# EAGLE design 611_jetbot_126 (EAGLE 9.6.2)
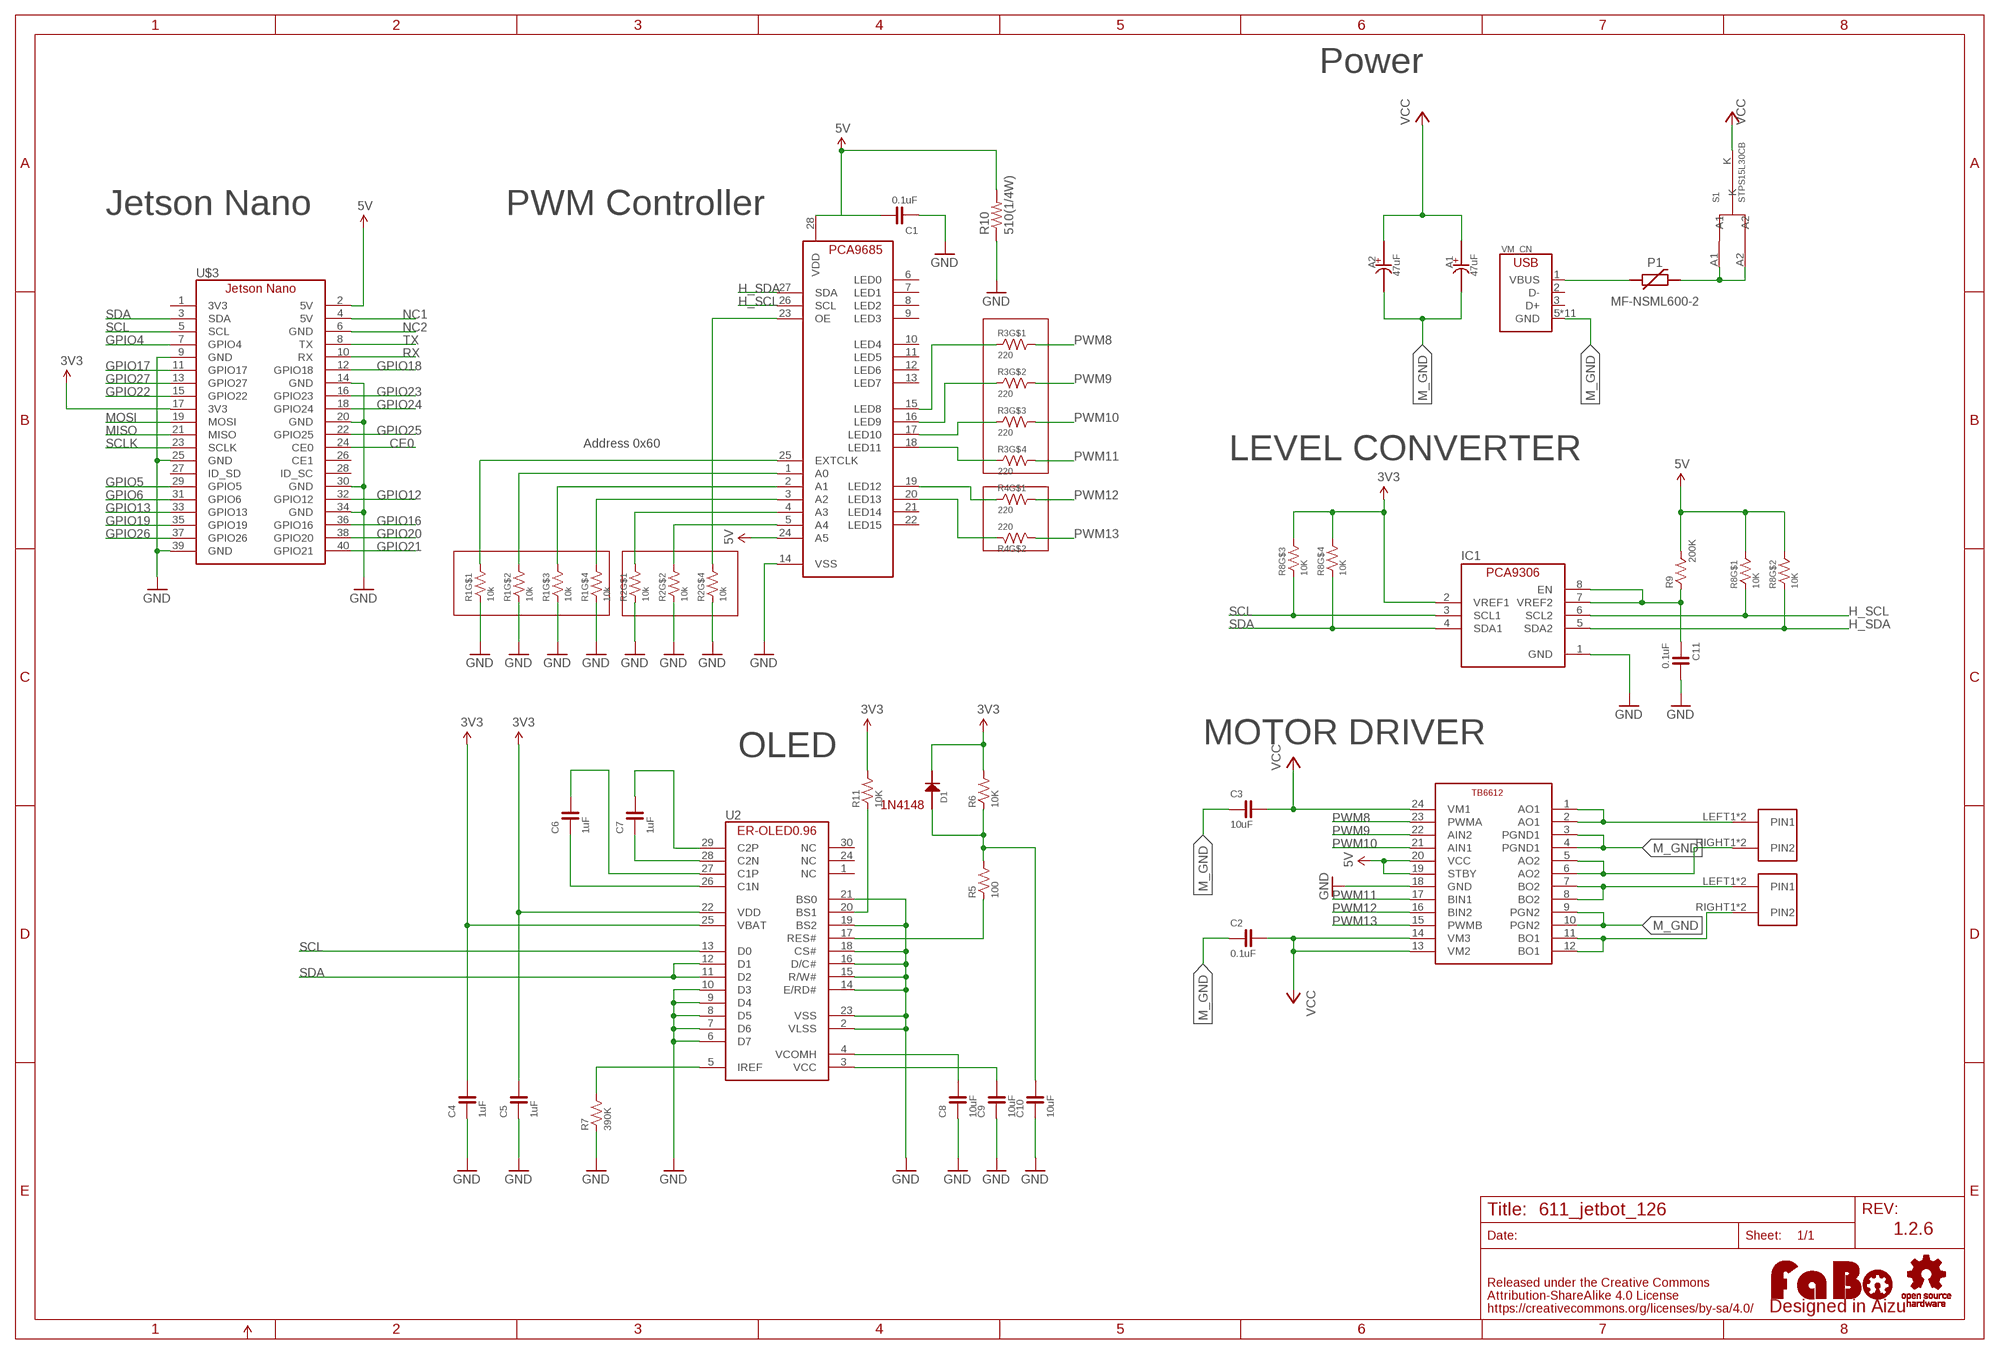
[diagram p0: schematic, sheet 1]

## Parts
A1  47uF  CAPACITOR-ALUMIN_D60  [D60]
A2  47uF  CAPACITOR-ALUMIN_D60  [D60]
C1  0.1uF  CAPACITOR-0603  [0603]
C2  0.1uF  CAPACITOR-0603  [0603]
C3  10uF  CAPACITOR-0603  [0603]
C4  1uF  CAPACITOR-0603-BOTTOM  [0603-BOTTOM]
C5  1uF  CAPACITOR-0603-BOTTOM  [0603-BOTTOM]
C6  1uF  CAPACITOR-0603-BOTTOM  [0603-BOTTOM]
C7  1uF  CAPACITOR-0603-BOTTOM  [0603-BOTTOM]
C8  10uF  CAPACITOR-0603-BOTTOM  [0603-BOTTOM]
C9  10uF  CAPACITOR-0603-BOTTOM  [0603-BOTTOM]
C10  10uF  CAPACITOR-0603-BOTTOM  [0603-BOTTOM]
C11  0.1uF  CAPACITOR-0603  [0603]
D1  1N4148  [1N4148W]
IC1  PCA9306_SSOP  [8PIN-SSOP]
LOGO1  LOGO_FABO-M  [LOGO_FABO_M]
P1  MF-NSML600-2  POLYSWITCH1206  [1206]
R1  10k  RESISTOR_ARRAY  [EXBV8V]
R2  10k  RESISTOR_ARRAY  [EXBV8V]
R3  220  RESISTOR_ARRAY  [EXBV8V]
R4  220  RESISTOR_ARRAY  [EXBV8V]
R5  100  RESISTOR-0603-BOTTOM  [0603-BOTTOM]
R6  10K  RESISTOR-0603-BOTTOM  [0603-BOTTOM]
R7  390K  RESISTOR-0603-BOTTOM  [0603-BOTTOM]
R8  10K  RESISTOR_ARRAY  [EXBV8V]
R9  200K  RESISTOR-0603  [0603]
R10  510(1/4W)  R-US_R0805  [R0805]
R11  10K  RESISTOR-0603-BOTTOM  [0603-BOTTOM]
S1  STPS15L30CB  STPS15L30C  [STPS15L30C]
U2  ER-OLED0.96-1ER-CON30HT-1_REV2  [ER-CON30HT-1_REV2]
U$3  JETSON_NANO  [JETSON_NANO]
U$5  TB6612  [TB6612]
U$6  ML-1400-S1  [ML-1400-S1]
U$8  ML-1400-S1  [ML-1400-S1]
U$9  PCA9685  [PCA9685]
U$11  LOGO_OSHW-M_BOTTOM  [LOGO_OSHW_M_BOTTOM]
VM_CN  USB-ZX62D  [ZX62D-B-5PA8]

## Nets
3V3: C4.2 C5.2 D1.CATHODE IC1.2(VREF1) R6.2 R8.5 R8.6 R11.2 U2.22(VDD) U2.25(VBAT) U$3.17(3V3)
5V: C1.2 R8.7 R8.8 R9.2 R10.2 U$3.2(5V) U$5.19(STBY) U$5.20(VCC) U$9.24(A5) U$9.28(VDD)
CE0: U$3.24(CE0)
GND: C1.1 C4.1 C5.1 C8.1 C9.1 C10.1 C11.2 IC1.1(GND) R1.1 R1.2 R1.3 R1.4 R2.1 R2.2 R2.4 R7.1 R10.1 U2.2(VLSS) U2.6(D7) U2.7(D6) U2.8(D5) U2.9(D4) U2.10(D3) U2.14(E/RD#) U2.15(R/W#) U2.16(D/C#) U2.18(CS#) U2.19(BS2) U2.21(BS0) U2.23(VSS) U$3.9(GND) U$3.14(GND) U$3.20(GND) U$3.25(GND) U$3.30(GND) U$3.34(GND) U$3.39(GND) U$5.18(GND) U$9.14(VSS)
GPIO4: U$3.7(GPIO4)
GPIO5: U$3.29(GPIO5)
GPIO6: U$3.31(GPIO6)
GPIO12: U$3.32(GPIO12)
GPIO13: U$3.33(GPIO13)
GPIO16: U$3.36(GPIO16)
GPIO17: U$3.11(GPIO17)
GPIO18: U$3.12(GPIO18)
GPIO19: U$3.35(GPIO19)
GPIO20: U$3.38(GPIO20)
GPIO21: U$3.40(GPIO21)
GPIO22: U$3.15(GPIO22)
GPIO23: U$3.16(GPIO23)
GPIO24: U$3.18(GPIO24)
GPIO25: U$3.22(GPIO25)
GPIO26: U$3.37(GPIO26)
GPIO27: U$3.13(GPIO27)
H_SCL: IC1.6(SCL2) R8.1 U$9.26(SCL)
H_SDA: IC1.5(SDA2) R8.2 U$9.27(SDA)
M_GND: A1.MINUS(-) A2.MINUS(-) C2.1 C3.1 U$5.3(PGND1) U$5.4(PGND1) U$5.9(PGN2) U$5.10(PGN2) VM_CN.5(GND) VM_CN.B1(GND) VM_CN.B2(GND) VM_CN.B3(GND) VM_CN.B4(GND) VM_CN.T1(GND) VM_CN.T2(GND) VM_CN.T3(GND) VM_CN.T4(GND) VM_CN.T5(GND) VM_CN.T6(GND)
MISO: U$3.21(MISO)
MOSI: U$3.19(MOSI)
N$2: R3.4 U$9.18(LED11)
N$3: R3.3 U$9.17(LED10)
N$4: R3.2 U$9.16(LED9)
N$5: R3.1 U$9.15(LED8)
N$6: R4.1 U$9.19(LED12)
N$7: R2.5 U$9.23(OE)
N$8: R1.8 U$9.25(EXTCLK)
N$9: R1.7 U$9.1(A0)
N$10: R1.6 U$9.2(A1)
N$11: R1.5 U$9.3(A2)
N$12: R2.8 U$9.4(A3)
N$13: R2.7 U$9.5(A4)
N$14: C6.2 U2.27(C1P)
N$15: R4.2 U$9.20(LED13)
N$16: C6.1 U2.26(C1N)
N$17: U$5.1(AO1) U$5.2(AO1) U$6.LEFT1(PIN1) U$6.LEFT2(PIN1)
N$18: U$5.5(AO2) U$5.6(AO2) U$6.RIGHT1(PIN2) U$6.RIGHT2(PIN2)
N$19: C7.1 U2.28(C2N)
N$20: U$5.7(BO2) U$5.8(BO2) U$8.LEFT1(PIN1) U$8.LEFT2(PIN1)
N$21: C7.2 U2.29(C2P)
N$22: U$5.11(BO1) U$5.12(BO1) U$8.RIGHT1(PIN2) U$8.RIGHT2(PIN2)
N$23: R7.2 U2.5(IREF)
N$24: C8.2 U2.4(VCOMH)
N$25: C9.2 U2.3(VCC)
N$26: R5.1 U2.17(RES#)
N$27: C10.2 D1.ANODE R5.2 R6.1
N$28: R11.1 U2.20(BS1)
N$29: C11.1 IC1.7(VREF2) IC1.8(EN) R9.1
NC1: U$3.4(5V)
NC2: U$3.6(GND)
PTCP1: P1.P$1 VM_CN.1(VBUS)
PTCP2: P1.P$2 S1.A1 S1.A2
PWM8: R3.8 U$5.23(PWMA)
PWM9: R3.7 U$5.22(AIN2)
PWM10: R3.6 U$5.21(AIN1)
PWM11: R3.5 U$5.17(BIN1)
PWM12: R4.8 U$5.16(BIN2)
PWM13: R4.7 U$5.15(PWMB)
RX: U$3.10(RX)
SCL: IC1.3(SCL1) R8.3 U2.13(D0) U$3.5(SCL)
SCLK: U$3.23(SCLK)
SDA: IC1.4(SDA1) R8.4 U2.11(D2) U2.12(D1) U$3.3(SDA)
TX: U$3.8(TX)
VCC: A1.PLUS(+) A2.PLUS(+) C2.2 C3.2 S1.K U$5.13(VM2) U$5.14(VM3) U$5.24(VM1)
Unconnected: R2.3 R2.6 R4.3 R4.4 R4.5 R4.6 U2.1(NC) U2.24(NC) U2.30(NC) U$3.1(3V3) U$3.26(CE1) U$3.27(ID_SD) U$3.28(ID_SC) U$9.6(LED0) U$9.7(LED1) U$9.8(LED2) U$9.9(LED3) U$9.10(LED4) U$9.11(LED5) U$9.12(LED6) U$9.13(LED7) U$9.21(LED14) U$9.22(LED15) VM_CN.2(D-) VM_CN.3(D+)

## Notes on the sheet
- Power
- Jetson Nano | PWM Controller
- Address 0x60
- LEVEL CONVERTER
- MOTOR DRIVER
- OLED
- 1N4148
- 1.2.6

## Library data of the parts
A1 A2 = FaBo-Capacitor:CAPACITOR-ALUMIN
C1-C11 = FaBo-Capacitor:CAPACITOR: CAPACITOR
D1 = FaBo-Diode:1N4148
IC1 = FaBo-LevelTranslator:PCA9306
LOGO1 = component:LOGO_FABO
P1 = FaBo-Supply:POLYSWITCH
R1-R4 R8 = component:RESISTOR_ARRAY
R5-R7 R9 R11 = FaBo-Resistors:RESISTOR: RESISTOR
R10 = rcl:R-US_: RESISTOR, American symbol; SPICEPREFIX: R
S1 = FaBo-Supply:STPS15L30C
U2 = FaBo-Display:ER-OLED0.96-1: ER-CON30HT-1 Rev2 wide distance 0.23mm
U$3 = FaBo-Boards:JETSON_NANO
U$5 = FaBo-Motor:TB6612
U$6 U$8 = FaBo-Terminal:ML-1400-S1
U$9 = FaBo-Motor:PCA9685
U$11 = component:LOGO_OSHW
VM_CN = component:USB

## Board
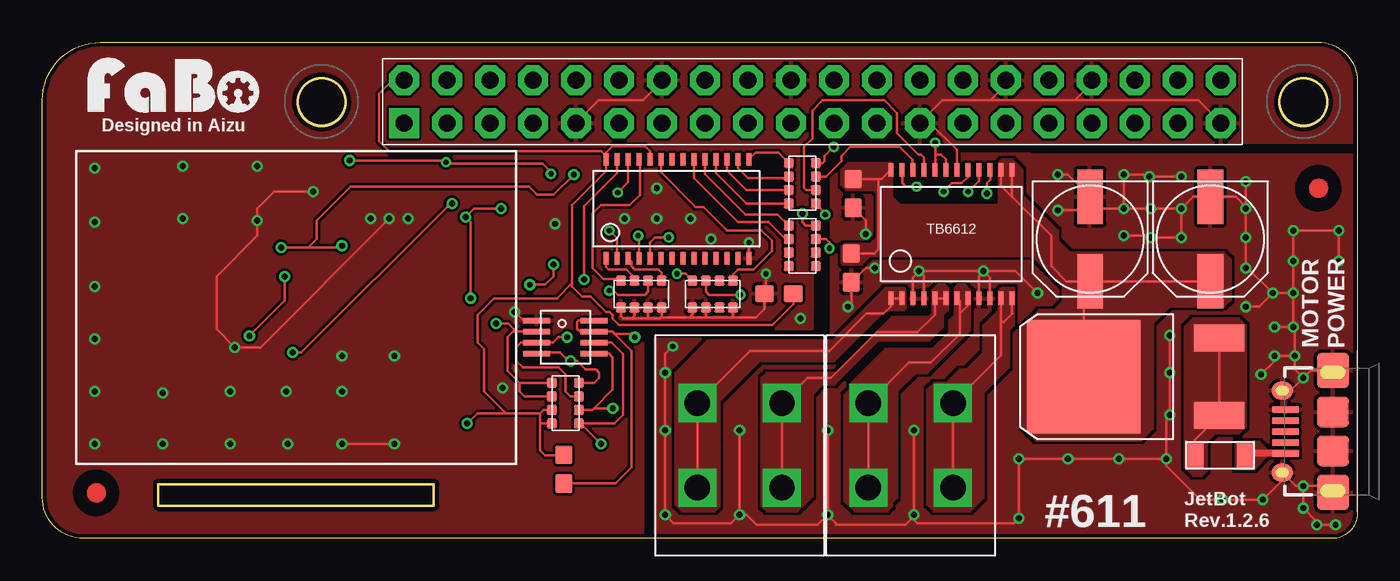
[diagram p1: board, top side]
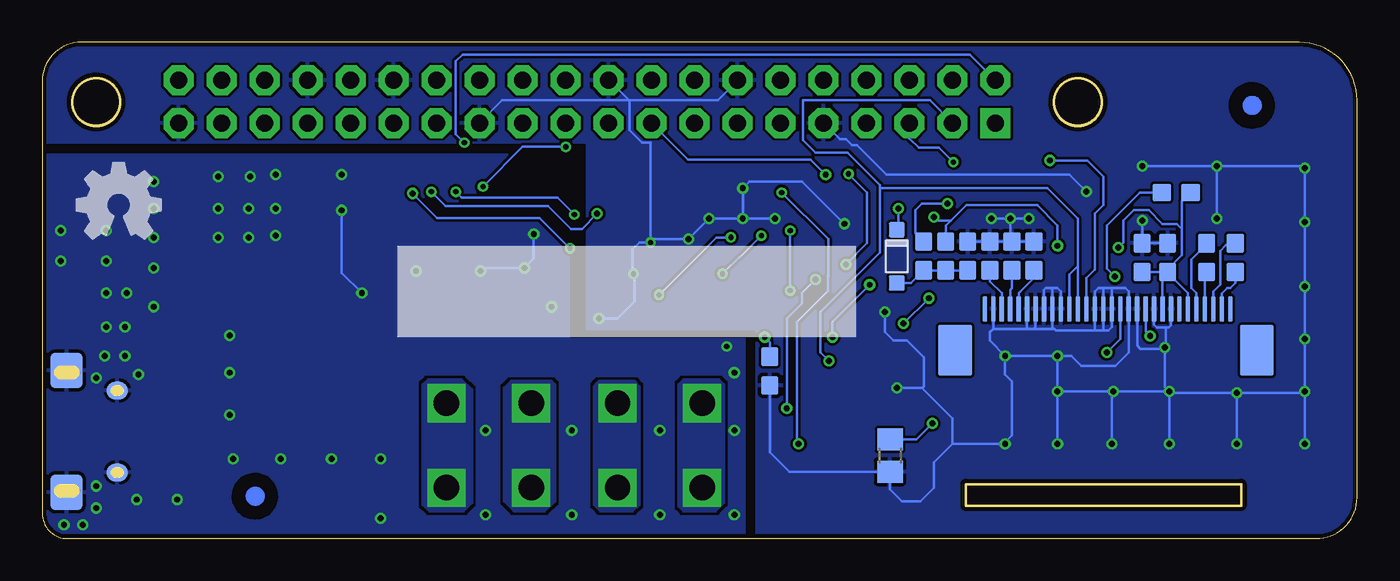
[diagram p2: board, bottom side, seen from below]

Size 77.68 x 29.33 mm. Coordinates in mm from the lower left corner, seen from the top.
Outline: 6.85,1.94 23.13,1.94 23.13,3.21 6.85,3.21 6.85,1.94
Outline: circle at 16.5,25.8 radius 1.4
Outline: circle at 74.5,25.8 radius 1.4
Copper layers (1*16): Top 0.035mm / dielectric 1.6mm / Bottom 0.035mm
Design rules "PCBway": minimum track width 6mil, minimum drill 12mil, track to track 6mil, track to pad 6mil, pad to pad 6mil, via to via 6mil, smd to smd 6mil, copper to edge 10mil, drill to drill 10mil, minimum pad ring 10mil, minimum via ring 6mil, stop-mask expansion 2mil, vias tented up to drill 100mil, thermal gap 8mil
tRestrict: area 51.2,13.3 to 52.3,13.7
bRestrict: 7 lines

### Footprints (pad centres in the part's own frame; a part is rotated, then mirrored left to right if it is on the bottom)
D60 = smd 3.2 x 1.524: MINUS -2.5,0; PLUS 2.5,0
0603 = smd 1.1 x 1: 1 -0.85,0; 2 0.85,0
0603-BOTTOM = smd 1.1 x 1 bottom: 1 -0.85,0; 2 0.85,0
1N4148W = smd 0.9 x 0.95: ANODE 0,0; CATHODE 3.15,0
8PIN-SSOP = smd 0.3 x 1.6: 1 -0.975,-1.7; 2 -0.325,-1.7; 3 0.325,-1.7; 4 0.975,-1.7; 5 0.975,1.7; 6 0.325,1.7; 7 -0.325,1.7; 8 -0.975,1.7
1206 = smd 1 x 1.6: P$1 -1.5,0; P$2 1.5,0
EXBV8V = smd 0.6 x 0.6: 1 -1.2,-0.8; 2 -0.4,-0.8; 3 0.4,-0.8; 4 1.2,-0.8; 5 1.2,0.8; 6 0.4,0.8; 7 -0.4,0.8; 8 -1.2,0.8
R0805 = smd 1.3 x 1.5: 1 -0.95,0; 2 0.95,0
STPS15L30C = smd 1.6 x 3: A1 -2.286,-6.13; A2 2.286,-6.13 | smd 6.7 x 6.7: K 0,1.87
ER-CON30HT-1_REV2 = smd 0.27 x 1.5 bottom: 1 7,-0.23; 2 6.5,-0.23; 3 6,-0.23; 4 5.5,-0.23; 5 5,-0.23; 6 4.5,-0.23; 7 4,-0.23; 8 3.5,-0.23; 9 3,-0.23; 10 2.5,-0.23; 11 2,-0.23; 12 1.5,-0.23; 13 1,-0.23; 14 0.5,-0.23; 15 0,-0.23; 16 -0.5,-0.23; 17 -1,-0.23; 18 -1.5,-0.23; 19 -2,-0.23; 20 -2.5,-0.23; 21 -3,-0.23; 22 -3.5,-0.23; 23 -4,-0.23; 24 -4.5,-0.23; 25 -5,-0.23; 26 -5.5,-0.23; 27 -6,-0.23; 28 -6.5,-0.23; 29 -7,-0.23; 30 -7.5,-0.23 | smd 2 x 3 bottom: 31 -9.07,-2.67; 32 8.74,-2.67
JETSON_NANO = drill 1 pad 1.778 square: 1 -24.13,10.16 | drill 1 pad 1.778 octagon: 2 -24.13,12.7; 3 -21.59,10.16; 4 -21.59,12.7; 5 -19.05,10.16; 6 -19.05,12.7; 7 -16.51,10.16; 8 -16.51,12.7; 9 -13.97,10.16; 10 -13.97,12.7; 11 -11.43,10.16; 12 -11.43,12.7; 13 -8.89,10.16; 14 -8.89,12.7; 15 -6.35,10.16; 16 -6.35,12.7; 17 -3.81,10.16; 18 -3.81,12.7; 19 -1.27,10.16; 20 -1.27,12.7; 21 1.27,10.16; 22 1.27,12.7; 23 3.81,10.16; 24 3.81,12.7; 25 6.35,10.16; 26 6.35,12.7; 27 8.89,10.16; 28 8.89,12.7; 29 11.43,10.16; 30 11.43,12.7; 31 13.97,10.16; 32 13.97,12.7; 33 16.51,10.16; 34 16.51,12.7; 35 19.05,10.16; 36 19.05,12.7; 37 21.59,10.16; 38 21.59,12.7; 39 24.13,10.16; 40 24.13,12.7
TB6612 = smd 0.3 x 0.8: 1 -3.575,-3.8; 2 -2.925,-3.8; 3 -2.275,-3.8; 4 -1.625,-3.8; 5 -0.975,-3.8; 6 -0.325,-3.8; 7 0.325,-3.8; 8 0.975,-3.8; 9 1.625,-3.8; 10 2.275,-3.8; 11 2.925,-3.8; 12 3.575,-3.8; 13 3.575,3.8; 14 2.925,3.8; 15 2.275,3.8; 16 1.625,3.8; 17 0.975,3.8; 18 0.325,3.8; 19 -0.325,3.8; 20 -0.975,3.8; 21 -1.625,3.8; 22 -2.275,3.8; 23 -2.925,3.8; 24 -3.575,3.8
ML-1400-S1 = drill 1.5 square: LEFT1 -2.5,2.5; LEFT2 -2.5,-2.5; RIGHT1 2.5,2.5; RIGHT2 2.5,-2.5
PCA9685 = smd 0.3 x 0.75: 1 -4.15,-2.93; 2 -3.5,-2.93; 3 -2.85,-2.93; 4 -2.2,-2.93; 5 -1.55,-2.93; 6 -0.9,-2.93; 7 -0.25,-2.93; 8 0.4,-2.93; 9 1.05,-2.93; 10 1.7,-2.93; 11 2.35,-2.93; 12 3,-2.93; 13 3.65,-2.93; 14 4.3,-2.93; 15 4.3,2.92; 16 3.65,2.92; 17 3,2.92; 18 2.35,2.92; 19 1.7,2.92; 20 1.05,2.92; 21 0.4,2.92; 22 -0.25,2.92; 23 -0.9,2.92; 24 -1.55,2.92; 25 -2.2,2.92; 26 -2.85,2.92; 27 -3.5,2.92; 28 -4.15,2.92
ZX62D-B-5PA8 = smd 0.4 x 1.6: 1 -1.3,4.25; 2 -0.65,4.25; 3 0,4.25; 4 0.65,4.25; 5 1.3,4.25 | smd 1.05 x 1.25 bottom: B1 -2.425,4.45; B2 2.425,4.45 | smd 2.1 x 1.9 bottom: B3 -3.6,1.45; B4 3.6,1.45 | smd 1.05 x 1.25: T1 -2.425,4.45; T2 2.425,4.45 | smd 2.1 x 1.9: T3 -3.6,1.45; T6 3.6,1.45 | smd 1.8 x 1.9: T4 -1.15,1.45; T5 1.15,1.45

### Placement (x,y rotation side)
A1  69,17.7 270 top
A2  61.9,17.7 270 top
C1  43.52,14.47 0 top
C2  47.8,16 90 top
C3  47.9,20.4 90 top
C4  11.2,16.6 270 top
C5  12.7,16.6 270 top
C6  8.9,16.6 270 top
C7  7.2,16.6 270 top
C8  20.4,16.7 270 top
C9  21.7,16.7 270 top
C10  23,16.7 270 top
C11  34.7,9.9 270 bottom
D1  27.2,15.1 90 bottom
IC1  30.9,11.9 270 top
LOGO1  7.76,24.8 0 top
P1  69.58,4.92 180 top
R1  35.39,14.44 0 top
R2  39.6,14.44 0 top
R3  44.9,21 270 top
R4  44.9,17.3 270 top
R5  25.6,16.7 270 top
R6  24.3,16.7 90 top
R7  19.1,16.7 270 top
R8  30.9,8 90 top
R9  30.8,4.1 90 top
R10  27.6,4.9 90 bottom
R11  10.7,20.45 180 top
S1  63.39,9.57 90 top
U2  15,13.8 0 top
U$2  [MARK_POINT_3MM]  3.2,2.7 0 top
U$3  45.5,14.4 0 top
U$4  [MARK_POINT_3MM]  75.4,20.7 0 top
U$5  53.7,18 0 top
U$6  41.2,5.5 0 top
U$7  [MARK_POINT_3MM]  6.2,25.6 0 bottom
U$8  51.3,5.5 0 top
U$9  37.45,19.49 0 top
U$10  [MARK_POINT_3MM]  65.1,2.5 0 bottom
U$11  73.16,19.72 0 top
VM_CN  77.7,6.32 90 top

### Tracks (layer width: path | path; a pad name or v marks a point on that pad's centre or on a via)
3V3  (via drill 0.35)
  Top 0.152: R8.5 28.2,9.2 | 28.2,9.2 27.5,9.9 27.5,11.9 27.82,12.22 28,12.22 | 28,12.22 IC1.2 | R8.6 28.5,8.4 28.2,8.7 28.2,9.2 | v26.8,12.7 27.52,12.7 28,12.22 | v14.1,17.2 15.7,17.2 | 15.7,17.2 17.6,17.2 v17.7,17.3 | v31.4,21.5 30.22,20.32 29.23,20.32 28.75,20.8 18.2,20.8 16.2,18.8 16.2,17.7 15.7,17.2 | v25.3,14.2 25.3,18.7 v25,19 25.5,19.5 v27.1,19.5
  Bottom 0.152: 11.03,15.58 11.07,15.63 | C4.2 11.07,15.75 11.07,15.63 | 11.07,15.63 11.07,15.58 10,14.5 U2.25 | 14.1,17.15 v14.1,17.2 13.8,17.5 13.8,18.8 13.2,19.4 12.3,19.4 11.5,18.6 10.65,18.6 10.35,18.3 | R6.2 24.3,18.5 24,18.8 | 24,18.8 23.1,19.7 18.9,19.7 17.7,18.5 v17.7,17.3 | v26.8,12.7 v25.3,14.2 | v25,19 24.8,18.8 24,18.8 | D1.CATHODE 27.1,18.35 v27.1,19.5 | v31.4,21.5 32.3,22.4 39.53,22.4 U$3.17 | R11.2 10.35,19.95 10.35,18.3 | C4.2 11.2,15.89 | 11.2,15.89 10.35,16.75 10.35,18.3 | C5.2 11.34,15.75 11.2,15.89 | U2.22 11.5,15.45 C4.2
5V  (via drill 0.3, 0.35)
  Top 0.152: 29.4,7.4 29.6,7.6 R8.7 | 27.4,7.4 26.1,8.7 26.1,11.2 25.7,11.6 25.7,13.2 26.7,14.2 30.4,14.2 31.3,15.1 | 27.4,7.4 29.4,7.4 | U$9.24 35.9,22.9 35.6,23.2 33.7,23.2 33.3,22.8 33.3,22.6 | 53.3,21.88 U$5.19 53.38,22.42 53.1,22.7 52.75,22.7 | 31.3,15.1 31.3,14.9 31.9,14.3 32.4,14.3 33.3,13.4 33.5,13.4 33.7,13.2 33.7,13 34.07,12.63 34.8,12.63 34.81,12.62 43.12,12.62 44.37,13.87 C1.2 | 31.3,15.1 31.3,19.7 33.3,21.7 U$9.28 | U$5.20 52.75,21.83 52.75,22.7 | v52.75,23.4 52.75,22.7 | 33.3,22.5 U$9.28 | U$9.28 33.3,22.6 | 33.3,22.6 33,22.9 20.5,22.9 19.9,23.5 19.9,26.3 20.7,27.1 U$3.2 | v25.1,6.8 25.7,7.4 27.4,7.4 | R9.2 30.75,4.9 29.7,4.9 29.4,5.2 29.4,6.9 | 29.4,7.4 29.4,6.9 | R8.8 29.5,6.8 29.4,6.9
  Bottom 0.152: v52.75,23.4 53.25,23.9 53.25,28.2 52.84,28.61 22.88,28.61 U$3.2 | R10.2 26.05,5.85 v25.1,6.8
GND  (via drill 0.3, 0.35)
  Top 0.152: 56,25.9 53.19,25.9 U$3.25 52.44,24.56 54.02,22.98 U$5.18 | R1.1 34.19,13.11 34.3,13 34.8,13 | 36.55,13.05 36.5,13 35.7,13 | 36.55,13.05 36.6,13.1 R1.4 | 34.8,13 35.7,13 | R1.3 35.79,13.09 35.7,13 | R1.2 34.99,13.19 34.8,13 | R2.1 38.4,13.25 38.2,13.05 | 36.55,13.05 38.2,13.05 | R2.4 40.8,13.11 40.75,13.05 | 38.2,13.05 39.2,13.05 | 39.2,13.05 40.75,13.05 | R2.2 39.2,13.05 | 40.75,13.05 42.15,13.05 42.66,13.56 C1.1 42.75,14.56 v42.75,15.65 | U$9.14 v41.75,17.5 | IC1.1 28.43,12.88 v27.9,13.4 | v20.5,18.9 12.9,11.3 v11.37,11.3 10.3,12.37 10.3,15.5 12.7,17.9 v12.7,18.8 12.7,19.5 13.7,20.5 v16,20.5 | U$3.30 56.93,26.83 56,25.9 | U$3.39 68.29,25.9 61,25.9 | 56,25.9 61,25.9 | U$3.34 62.01,26.91 61,25.9 | U$3.14 36.61,27.01 35.5,25.9 32.87,25.9 U$3.9 | v20.8,5.6 v17.7,5.6
  Bottom 0.152: 11.2,17.6 C4.1 C5.1 v12.7,18.8 | v41.75,17.5 41.75,23.4 42.25,23.4 43,24.15 43,25.9 | 43,25.9 37.75,25.9 36.61,27.04 U$3.14 | v36.3,18.9 v36.3,20.7 35.9,21.1 32.8,21.1 v30.3,18.6 | v36.3,18.9 v38.3,18.9 v39.5,17.7 41.55,17.7 v41.75,17.5 | v36.3,18.9 v34.4,18.9 | v41.75,17.5 42.4,17.5 42.8,17.1 42.8,15.7 v42.75,15.65 42.7,15.6 42.7,14 43.7,13 v44.8,13 | 27.9,13.5 v27.9,13.4 27.9,12.2 27.4,11.7 26.6,11.7 25.6,10.7 25.6,9 25.7,8.9 | 43,25.9 43.03,25.9 | 43.03,25.9 U$3.20 | U$3.25 50.51,25.9 43.03,25.9 | 21.5,12.4 19.4,12.4 | 19.4,12.4 19.1,12.4 | 19.1,12.4 17.9,12.4 | 17.9,12.4 18,12.5 U2.9 18,14.7 18.1,14.8 | 11.3,12.47 11.82,12.47 12,12.65 U2.21 | 11.3,12.47 11.12,12.47 11,12.6 U2.23 | R7.1 C8.1 | C8.1 C9.1 C10.1 | C8.1 20.5,17.65 v20.5,18.9 | 11.3,12.47 11.3,11.37 v11.37,11.3 11.37,11.2 | 21.5,12.4 21.7,12.2 21.7,11.7 v20.8,10.8 | v16,20.5 17,21.51 27.8,21.51 29.54,23.24 29.85,23.24 30.21,23.6 30.57,23.6 U$3.9 | v19.4,18.9 v20.5,18.9 | v20.5,18.9 v21.6,18.9 | v12.7,22 8.4,22 | 8.4,22 v8.3,22 3.2,22 v3.1,21.9 v3.1,18.7 v3.1,14.9 v3.1,11.8 v3.1,8.7 | v3.1,8.7 3.2,8.6 v7.1,8.6 | 11.37,11.2 11.37,8.97 v11.1,8.7 | v11.1,8.7 11,8.6 v7.1,8.6 | v11.1,8.7 v14.4,8.7 | v14.4,8.7 v17.7,8.7 | v17.7,10.8 v17.7,8.7 | v3.1,8.7 v3.1,5.6 | v7.1,8.6 v7.1,5.6 | v11.1,8.7 v11.1,5.6 | v14.4,8.7 14.5,8.6 v14.5,5.6 | v17.7,8.7 v17.7,5.6 | v20.8,5.6 20.9,5.6 | 20.9,5.6 23.9,5.6 | v8.3,18.9 8.3,21.9 8.4,22 | 23.9,5.6 25,4.5 25,3 25.8,2.2 26.9,2.2 27.6,2.9 R10.1 33.55,3.95 34.7,5.1 C11.2 | 23.9,5.6 23.9,7.1 25.7,8.9 | 25.7,8.9 v27.2,8.9 | U2.19 13,11.4 12.8,11.2 11.37,11.2 | v17.7,10.8 16.9,10.8 16.3,10.2 14.3,10.2 13.5,11 U2.18 13.5,14.6 13.7,14.8 14.5,14.8
  Bottom 0.152: 17.9,12.4 17.8,12.3 15.6,12.3 | 15,12.3 14.7,12.3 14.5,12.5 U2.16 14.5,14.8 | 15,12.3 15.6,12.3 | 15,12.3 U2.15 15,14.8 | 15.6,12.3 15.5,12.4 U2.14 15.5,14.6 15.3,14.8 15,14.8 | 18.1,14.8 17.7,14.8 17.5,14.6 U2.10 | 18.1,14.8 18.4,14.8 18.5,14.7 U2.8 | U2.2 21.5,12.4 | U2.6 19.5,12.5 19.4,12.4 | U2.7 19,12.5 19.1,12.4 | 14.5,14.8 15,14.8 | v20.8,10.8 v17.7,10.8 | v20.8,10.8 20.8,9.69 20.4,9.29 20.4,6.1 20.9,5.6
  pour Top: -0.5,-0.33 35.5,-0.33 35.5,12.4 45.5,12.4 45.5,23.4 77.5,23.4 77.5,29.77 -0.5,29.77
  pour Bottom: -0.5,-0.33 35.5,-0.33 35.5,12.4 45.5,12.4 45.5,23.4 77.5,23.4 77.5,29.77 -0.5,29.77
H_SCL  (via drill 0.3, 0.35)
  Top 0.152: IC1.6 33.62,11.58 34.3,10.9 34.3,7.3 33.8,6.8 R8.1 31.8,6.8 v33,5.6 | U$9.26 34.6,21.05 v34,20.45
  Bottom 0.152: v34,20.45 31.25,17.7 31.25,15.54 31.26,15.53 31.26,14.64 33.1,12.8 33.1,5.6 v33,5.6
H_SDA  (via drill 0.35)
  Top 0.152: R8.2 32.5,7.6 32.6,7.7 | 32.6,7.7 33.7,8.8 33.7,10.7 33.48,10.93 IC1.5 | v32,15.3 32,19.65 33.95,21.6 U$9.27 | v33.7,7.7 32.6,7.7
  Bottom 0.152: v32,15.3 32.8,14.5 32.8,13.9 33.7,13 v33.7,7.7
M_GND  (via drill 0.3, 0.35)
  Top 0.152: v49.2,16 48.65,16 C2.1 47.8,13.9 v47.6,13.7 | v48.64,18 48.64,18.81 C3.1 | U$5.3 51.42,15.42 v51.8,15.8 | U$5.4 52.08,15.53 v51.8,15.8 | U$5.9 55.33,15.53 v55.6,15.8 | U$5.10 55.98,15.42 v55.6,15.8 | v51.8,15.8 v55.6,15.8 | v55.6,15.8 57.5,15.8 v58.8,14.5 | v66.4,4.7 v63.6,4.7 v60.6,4.7 v57.7,4.7 v57.7,1.2 57.4,0.9 51.7,0.9 51.5,1.1 51.5,1.3 | v66.4,4.7 66.4,4.3 68.4,2.3 v69.7,2.3 v72.1,2.3 73.25,3.45 VM_CN.T1 74.05,3.1 v74.5,3.1 | v74.5,3.1 75.87,3.1 VM_CN.T3 | v74.5,3.1 v74.5,1.8 75.3,1 v75.3,0.8 v76.4,0.8 | v72.7,14.5 71.2,16 v71.1,16 v71.1,17.8 v71.1,19.5 71.1,19.6 | v72.7,14.5 71.9,13.7 v71.1,13.7 | 71.1,19.6 v71.1,21.1 | 71.1,19.6 70.5,20.2 A1.MINUS 68,20.2 v67.3,19.5 | v72.7,14.5 v73.9,14.5 | v73.9,14.5 v73.9,12.5 | v73.9,12.5 v72.8,12.5 | v73.9,12.5 74,12.4 v74,10.8 | v74,10.8 v72.8,10.8 72.8,10.5 v72,9.7 | v74,10.8 74,10 v74.5,9.5 | v74.5,9.5 73.75,8.75 VM_CN.T2 | v74.5,9.5 74.92,9.92 VM_CN.B4 | v73.9,14.5 v73.9,16.4 v73.9,18.2 v76.6,18.2 v76.6,16.4 | v66.4,4.7 66.4,7.1 v66.6,7.3 v66.6,9.8 v66.6,12 | v63.9,17.9 65.4,17.9 v65.5,17.8 v67.3,17.8 v67.3,19.5 | v67.3,19.5 v65.5,19.5 v63.9,19.5 | v63.9,19.5 v63.9,21.5 65.3,21.5 v65.4,21.4 v67.3,21.4 | v60,21.5 60.6,21.5 A2.MINUS | v60,19.4 61.1,19.4 A2.MINUS | v63.9,19.5 62.6,19.5 A2.MINUS | 51.5,1.3 v51.5,1.4 v51.5,6.4 | v41.2,1.4 40.7,0.9 37.3,0.9 v36.8,1.4 v36.8,6.4 v36.8,9.8 36.8,10.9 v37.25,11.35 | v41.2,1.4 41.6,1.4 42.2,0.8 45.8,0.8 v46.4,1.4 | v46.4,1.4 46.9,0.9 46.9,0.8 51,0.8 51.5,1.3 | v46.4,6.4 v46.4,1.4 | v41.2,6.4 v41.2,1.4
  Bottom 0.152: v48.64,18 48.64,16.56 v49.2,16 51.6,16 v51.8,15.8 | v58.8,14.5 60,15.7 v60,19.4
  pour Top (rank 6): 46.6,22.75 58.3,22.75 58.3,22.7 78.5,22.7 78.5,-1.1 36.2,-1.1 36.2,11.8 46.6,11.8
  pour Bottom (rank 6): 36.2,11.8 46.6,11.8 46.6,22.7 77.5,22.7 77.5,-0.4 77.4,-0.5 36.2,-0.5
N$2
  Top 0.152: R3.4 41.6,19.8 39.8,21.6 U$9.18
N$3
  Top 0.152: U$9.17 40.45,21.75 41.6,20.6 R3.3
N$4
  Top 0.152: R3.2 44,21.3 41.7,21.3 41.1,21.9 U$9.16
N$5
  Top 0.152: U$9.15 42.14,22.8 43.5,22.8 R3.1
N$6
  Top 0.152: U$9.19 39.15,21.55 41.54,19.16 43.1,19.16 43.33,19.16 43.44,19.16 R4.1
N$7
  Top 0.152: R2.5 40.8,15.6 41.1,15.9 42,15.9 43.1,17 43.1,17.6 42.5,18.2 40.45,18.2 39.05,19.6 38.6,19.6 36.55,21.65 U$9.23
N$8
  Top 0.152: R1.8 34.09,15.35 33.16,15.35 32.5,16 32.5,19.2 33,19.7 34.7,19.7 35.3,20.3 35.3,22.37 U$9.25
N$9
  Top 0.152: R1.7 34.99,15.41 34.5,15.9 33.45,15.9 33.3,16.05 U$9.1 33.27,16.54
N$10  (via drill 0.3)
  Top 0.152: v33.5,14.65 33.75,14.65 34,14.4 35.6,14.4 35.79,14.59 R1.6 | v33.5,18.2 33.95,17.75 U$9.2
  Bottom 0.152: v33.5,18.2 v33.5,14.65
N$11
  Top 0.152: U$9.3 34.8,16.37 34.8,16.1 35,15.9 36.4,15.9 36.59,15.71 R1.5
N$12  (via drill 0.3)
  Top 0.152: 35.2,16.62 U$9.4 35.25,17.85 v35.2,17.9 | v37.5,15.65 38,15.65 R2.8
  Bottom 0.152: v37.5,15.65 36.5,16.65 36.45,16.65 v35.2,17.9
N$13  (via drill 0.3)
  Top 0.152: U$9.5 35.9,17.5 36.2,17.8 v37,17.8 | R2.7 39.2,14.6 39.4,14.4 v41.25,14.4
  Bottom 0.152: v41.25,14.4 37.85,17.8 v37,17.8
N$14
  Bottom 0.152: C6.2 8.97,15.67 9,15.65 U2.27
N$15
  Top 0.152: R4.2 43.9,17.7 42.9,18.7 41.1,18.7 38.5,21.3 U$9.20
N$16
  Bottom 0.152: C6.1 8.9,17.4 9.8,16.5 9.8,14.8 9.5,14.5 U2.26
N$17
  Top 0.152: U$6.LEFT2 U$6.LEFT1 41.8,11.1 46.5,11.1 48.7,13.3 49.7,13.3 50.12,13.72 U$5.1 U$5.2
  pour Top (no thermals): 37.4,2 37.8,1.6 39.7,1.6 40,1.9 40,8.1 42.4,10.5 46.8,10.5 49.65,13.35 50.1,13.5 50.9,13.5 51,13.6 51,14.7 50.9,14.8 49.8,14.8 46.7,11.7 39.3,11.7 37.4,9.8
  pour Bottom (no thermals): 37.4,2.1 37.9,1.6 39.8,1.6 40.1,1.9 40.1,2 40.1,9.1 39.8,9.4 37.7,9.4 37.4,9.1
N$18
  Top 0.152: U$5.6 U$5.5 52.73,13.22 51.7,12.2 49.3,12.2 46.6,9.5 45.2,9.5 U$6.RIGHT1 U$6.RIGHT2
  pour Top (no thermals): 42.5,1.9 42.8,1.6 44.6,1.6 45.5,2.5 45.5,8.5 46.1,9.1 46.8,9.1 49.4,11.7 52.4,11.7 53.2,12.5 53.2,13.2 53.5,13.5 53.5,14.8 53.3,15 52.9,15 52.6,14.7 52.6,13.3 52.4,13.1 50.2,13.1 46.9,9.8 42.8,9.8 42.5,9.5
  pour Bottom (no thermals): 42.6,9.2 42.4,9 42.4,2 42.8,1.6 44.7,1.6 44.8,1.7 45.1,2 45.1,2.1 45.1,9 44.9,9.2 44.8,9.3 42.7,9.3
N$19
  Bottom 0.152: C7.1 7.2,17.35 7.75,17.35 8.1,17 8.1,15 8.5,14.6 U2.28
N$20
  Top 0.152: U$8.LEFT2 U$8.LEFT1 51.2,10.4 52.5,10.4 54.2,12.1 54.2,13.3 | 54.2,13.3 54.2,14.03 U$5.7 | U$5.8 54.67,13.78 54.2,13.3
  pour Top (no thermals): 47.4,2.2 48,1.6 49.9,1.6 50.2,1.9 50.2,2.1 50.5,2.4 50.5,8.7 51.6,9.8 52.3,9.8 54.8,12.3 54.8,14.7 54.5,15 54.1,15 53.9,14.8 53.9,13.2 53.6,12.9 53.6,12.2 52.6,11.2 49.8,11.2 47.7,9.1 47.7,8.8 47.4,8.5
  pour Bottom (no thermals): 47.4,2.2 48,1.6 49.8,1.6 50.4,2.2 50.4,8.9 50,9.3 47.6,9.3 47.4,9.1 47.4,8.6
N$21
  Bottom 0.152: C7.2 7.2,15.09 7.49,14.8 7.67,14.8 8,14.47 U2.29
N$22
  Top 0.152: U$5.11 56.62,12.8 | 56.62,12.8 56.62,10.83 U$8.RIGHT1 U$8.RIGHT2 | U$5.12 57.27,13.33 57.3,13.3 56.8,12.8 56.62,12.8
  pour Top (no thermals): 52.3,2 52.7,1.6 54.8,1.6 55.6,2.4 55.6,8.6 57.1,10.1 57.1,12.3 57.4,12.6 57.4,14.8 56.7,14.8 56.5,14.6 56.5,13.5 55.6,12.6 55.6,11 54.6,10 54.2,10 53.4,9.2 52.7,9.2 52.3,8.8
  pour Bottom (no thermals): 52.3,8.8 52.9,9.4 54.9,9.4 55.2,9.1 55.2,2 54.8,1.6 52.8,1.6 52.3,2.1
N$23
  Bottom 0.152: R7.2 19.1,15.4 19.9,14.6 20,14.5 U2.5
N$24
  Bottom 0.152: C8.2 20.4,14.8 20.5,14.7 U2.4
N$25
  Bottom 0.152: C9.2 21.7,15.2 21,14.5 U2.3
N$26  (via drill 0.35)
  Top 0.152: v14.8,11 15.3,11 23.9,19.6 24,19.6 v24.2,19.8
  Bottom 0.152: R5.1 26.1,18.05 26.1,19.4 25.7,19.8 v24.2,19.8 | v14.8,11 14,11.8 U2.17
N$27
  Bottom 0.152: 23,15.7 C10.2 R6.1 R5.2 26.35,15.1 D1.ANODE
N$28  (via drill 0.35)
  Top 0.152: v12.23,11.98 14.31,14.06 v14.31,15.48
  Bottom 0.152: R11.1 12.85,20.45 14.79,18.5 14.79,15.96 v14.31,15.48 | v12.23,11.98 12.5,12.25 U2.20
N$29  (via drill 0.35)
  Top 0.152: R9.1 33.85,3.25 34.8,4.2 34.8,11.1 33.8,12.1 | 33.8,12.1 33.67,12.22 IC1.7 31.77,12.22 31.6,12.4 31.6,12.8 31.67,12.88 IC1.8 | v35,11.9 34.8,12.1 33.8,12.1
  Bottom 0.152: C11.1 34.7,11.6 v35,11.9
PTCP1
  Top 0.406: VM_CN.1 71.18,5.02 P1.P$1
  pour Top (no thermals): 70.5,4.1 70.5,5.6 70.6,5.7 71.6,5.7 71.9,5.7 72.4,5.2 72.6,5.2 74.2,5.2 74.2,4.9 72.4,4.9 71.6,4.1
PTCP2
  Top 0.152: P1.P$2 68.08,5.84 S1.A1 S1.A2
  pour Top (no thermals): 67.5,4.2 67.5,12.5 68,13 70.7,13 71.1,12.6 71.1,6.6 70.7,6.2 69.3,6.2 68.8,5.7 68.8,4 68.5,3.7 68,3.7
PWM8  (via drill 0.3)
  Top 0.152: U$5.23 50.8,21.77 50.8,21 51,20.8 v51.65,20.8 | v46.75,23.15 46.2,22.6 46.2,22.3 46.1,22.2 R3.8
  Bottom 0.152: v46.75,23.15 49.3,23.15 v51.65,20.8
PWM9
  Top 0.152: 45.75,21.4 R3.7 46.3,21.4 47.2,22.3 47.2,22.6 47.75,23.15 50.65,23.15 51.4,22.4 51.4,21.83 U$5.22
PWM10
  Top 0.152: U$5.21 52.08,22.52 51.9,22.7 51.75,22.7 50.5,23.95 50.5,25.15 49.75,25.9 46.1,25.9 45.5,25.3 45.5,23.65 45,23.15 45,20.75 45.15,20.6 R3.6
PWM11  (via drill 0.3)
  Top 0.152: v53.25,20.5 53.75,21 54.3,21 54.67,21.38 U$5.17 | R3.5 46.25,19.25 v46.25,19.15
  Bottom 0.152: v46.25,19.15 47.25,20.15 52.9,20.15 v53.25,20.5
PWM12  (via drill 0.3, 0.35)
  Top 0.152: v44.9,19.2 44.9,18.7 45.1,18.5 R4.8 | v54.7,20.5 55.33,21.12 U$5.16
  Bottom 0.152: v54.7,20.5 53.85,19.65 47.8,19.65 46.45,18.3 45.8,18.3 v44.9,19.2
PWM13  (via drill 0.3, 0.35)
  Top 0.152: 45.75,17.65 R4.7 46.3,17.7 46.5,17.5 v46.5,17.15 | v55.8,20.4 55.8,21 56,21.2 56,21.77 U$5.15
  Bottom 0.152: v46.5,17.15 48.3,18.95 54.35,18.95 v55.8,20.4
SCL  (via drill 0.3, 0.35)
  Top 0.152: v18.15,22.35 23.75,22.35 v23.85,22.25 23.95,22.15 29.55,22.15 30.05,21.65 v30.05,21.55 | R8.3 31.2,8.4 30.9,8.7 30.9,9.7 30.5,10.1 28.4,10.1 28,10.5 28,11.3 28.27,11.58 IC1.3 30.18,11.58 30.5,11.9 v31,11.9 | v30.2,16.2 30.2,15.5 29.7,15 v28.8,15
  Bottom 0.152: v30.2,16.2 28.95,17.45 28.95,20.45 v30.05,21.55 | v31,11.9 31,12.8 v28.8,15 | v18.15,22.35 15.95,22.35 15,21.4 15,19.7 15.5,19.2 15.5,15.9 16,15.4 U2.13 | v23.85,22.25 24.7,23.1 25.9,23.1 26.45,23.65 U$3.5
SDA  (via drill 0.35)
  Top 0.152: IC1.4 29.27,11 30.6,11 31.1,10.5 v31.2,10.5 31.6,10.5 32.1,10 32.7,10 32.9,9.8 32.9,9.5 32.6,9.2 R8.4
  Bottom 0.152: U$3.3 25.25,25.9 32.75,25.9 32.75,23.55 32,22.8 30.1,22.8 28.2,20.9 28.2,20.7 | v31.2,10.5 31.7,11 31.7,13.4 28.2,16.9 28.2,20.7 | 16.5,16.1 16.5,18.9 18.3,20.7 28.2,20.7 | 16.5,16.1 17,15.6 U2.11 | U2.12 16.5,16.1
VCC
  Top 0.152: C3.2 49.4,21.25 | 49.4,21.25 49.58,21.25 U$5.24 | 49.4,21.25 49.4,17.1 49.15,16.85 C2.2 | S1.K 61.52,14.82 A2.PLUS | A2.PLUS A1.PLUS | U$5.13 57.27,20.3 57.27,20.23 | 57.27,20.23 57.27,20.2 56.62,20.85 U$5.14 | A2.PLUS 60.5,15.2 59.6,16.1 59.6,17.9 57.27,20.23
  pour Top (no thermals): 57.9,6.6 58.7,5.8 64.9,5.8 65.6,6.5 65.6,12.7 66.6,13.7 69.8,13.7 70.2,14.1 70.2,16.5 69.8,16.9 60.7,16.9 60,17.6 60,18.2 57.9,20.3 57.9,21.8 57.3,22.4 56.7,22.4 56.5,22.2 56.5,19.8 56.4,19.7 50.7,19.7 50.2,20.2 50.2,22.2 47.6,22.2 47.2,21.8 47.2,20.9 47.5,20.6 49.1,20.6 49.3,20.4 49.3,17.8 48.9,17.4 47.4,17.4 47.3,17.3 47.2,17.3 47.2,16.3 47.3,16.2 48.4,16.2 48.9,16.7 58.5,16.7 60.3,14.9 60.3,14 59.8,13.5 58.9,13.5 57.9,12.5

### Text on the board
tPlace: Designed in Aizu | MOTOR / POWER | JetBot | #611 | Rev.1.2.6
Document: #611 JetBot Controller Board(Rev 1.2.6)
tDocu: Keepout